# EAGLE design rapidshark_mark_6.11 (EAGLE 6.5.0)
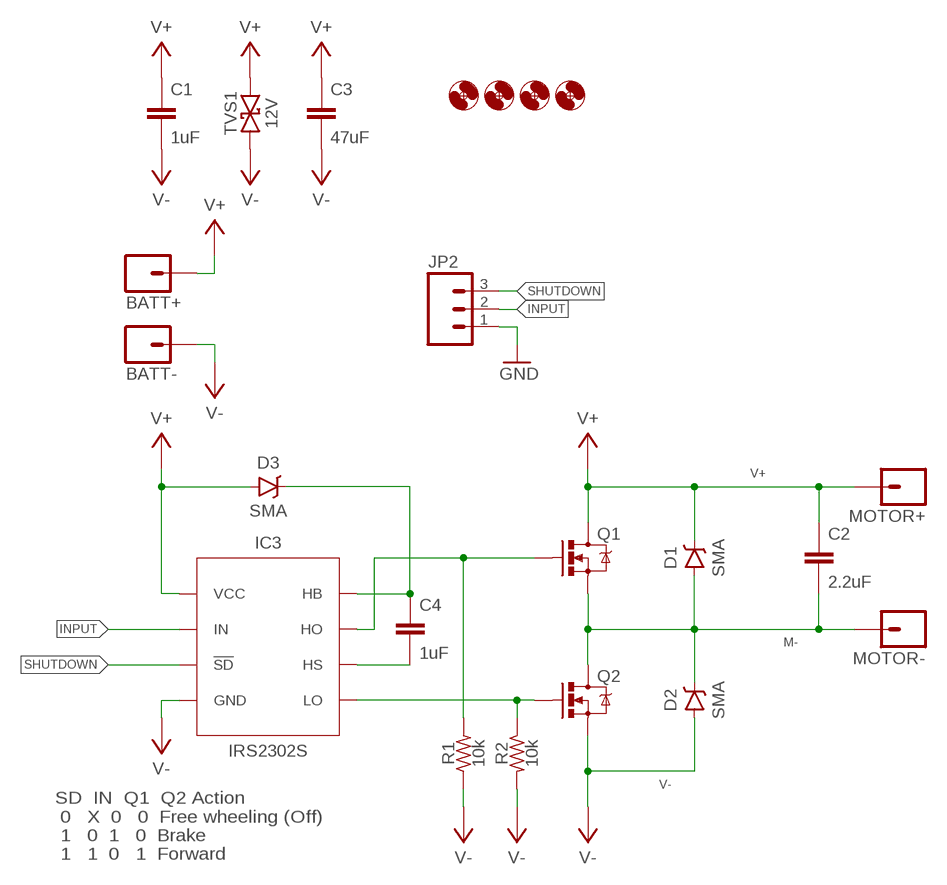
[diagram p0: schematic, sheet 1]

## Parts
BATT+  M01PTH_2MM  [1X01_2MM]
BATT-  M01PTH_2MM  [1X01_2MM]
C1  1uF  CAPACITOR-CERAMICC0805  [C0805]
C2  2.2uF  CAPACITOR-CERAMICC0805  [C0805]
C3  47uF  CAPACITOR-CERAMICC1206  [C1206]
C4  1uF  CAPACITOR-CERAMICC0805  [C0805]
D1  SMA  DIODE-SCHOTTKYSMA  [SMA-DIODE-SCHOTTKY]
D2  SMA  DIODE-SCHOTTKYSMA  [SMA-DIODE-SCHOTTKY]
D3  SMA  DIODE-SCHOTTKYSMA  [SMA-DIODE-SCHOTTKY]
H1  HOLE#2  [HOLE-#2]
H2  HOLE#2  [HOLE-#2]
H3  HOLE#2  [HOLE-#2]
H4  HOLE#2  [HOLE-#2]
IC3  IRS2302S  [SO08]
JP2  M03JST-PTH  [JST-3-PH-RA-PTH]
MOTOR+  M01PTH_2MM  [1X01_2MM]
MOTOR-  M01PTH_2MM  [1X01_2MM]
Q1  MOSFET-NCHANNELPSMN4R0-30YLD  [LFPAK56]
Q2  MOSFET-NCHANNELPSMN4R0-30YLD  [LFPAK56]
R1  10k  RESISTORR0805  [R0805]
R2  10k  RESISTORR0805  [R0805]
TVS1  12V  TVSDO-41-10.16MM  [DO-41-TVS-BI-10.16MM]

## Nets
GND: JP2.1
INPUT: IC3.2(IN) JP2.2
M-: C2.2 D1.A D2.C MOTOR-.1 Q1.1(S) Q1.2(S) Q1.3(S) Q2.MB@1(D) Q2.MB@2(D)
N$2: IC3.7(HO) Q1.4(G) R1.2
N$3: IC3.5(LO) Q2.4(G) R2.1
N$6: C4.1 D3.C IC3.8(HB)
N$7: C4.2 IC3.6(HS)
SHUTDOWN: IC3.3(!SD) JP2.3
V+: BATT+.1 C1.1 C2.1 C3.1 D1.C D3.A IC3.1(VCC) MOTOR+.1 Q1.MB@1(D) Q1.MB@2(D) TVS1.P$1
V-: BATT-.1 C1.2 C3.2 D2.A IC3.4(GND) Q2.1(S) Q2.2(S) Q2.3(S) R1.1 R2.2 TVS1.P$2

## Notes on the sheet
- SD  IN  Q1  Q2 Action
   0   X  0   0  Free wheeling (Off)
   1   0  1   0  Brake
   1   1  0   1  Forward

## Library data of the parts
BATT+ BATT- MOTOR+ MOTOR- = A_butts:M01: Header 1 Standard 1-pin 0.1" header. Use with straight break away headers (SKU : PRT-00116), right angle break away headers (PRT-00553), swiss pins (PRT-00743), machine pins (PRT-00117), and female headers (PRT-00115).
C1-C4 = A_butts:CAPACITOR-CERAMIC: CAPACITOR, European symbol
D1-D3 = A_butts:DIODE-SCHOTTKY: Schottky diodes in SFE's production catalog BAT20J 1A 23V 0.62Vf RB751 120mA 40V 0.37Vf PMEG4005EJ 0.5A 40V 0.42Vf MBRA140 1A 40V 0.5Vf B340A 3A 40V SMA
H1-H4 = A_butts:HOLE: MOUNTING HOLE with drill center marker
IC3 = A_butts:IRS2302S
JP2 = A_butts:M03: Header 3 Standard 3-pin 0.1" header. Use with straight break away headers (SKU : PRT-00116), right angle break away headers (PRT-00553), swiss pins (PRT-00743), machine pins (PRT-00117), and female headers (PRT-00115). Molex polarized connector foot print use with SKU : PRT-08232 with associated crimp pins and housings.; SKU: PRT-09915
Q1 Q2 = A_butts:MOSFET-NCHANNEL: Common NMOSFET Parts MFG P/N Store ID Prod ID FDD8780 TRANS-09984 SI7820DN TRANS-11055 FDS6630A IC-08089 2N7002PW TRANS-11151 FQP30N06L COM-10213 TRANS-10060 BSS123LT1G TRANS-08345 BSS138 TRANS-00830 BS170 2N7000
R1 R2 = A_butts:RESISTOR: RESISTOR, American symbol
TVS1 = A_butts:TVS: Transient voltage suppressor- prevents ESD on inputs. Ignore package description- MBRA140 is NOT this type of part!!!

## Board
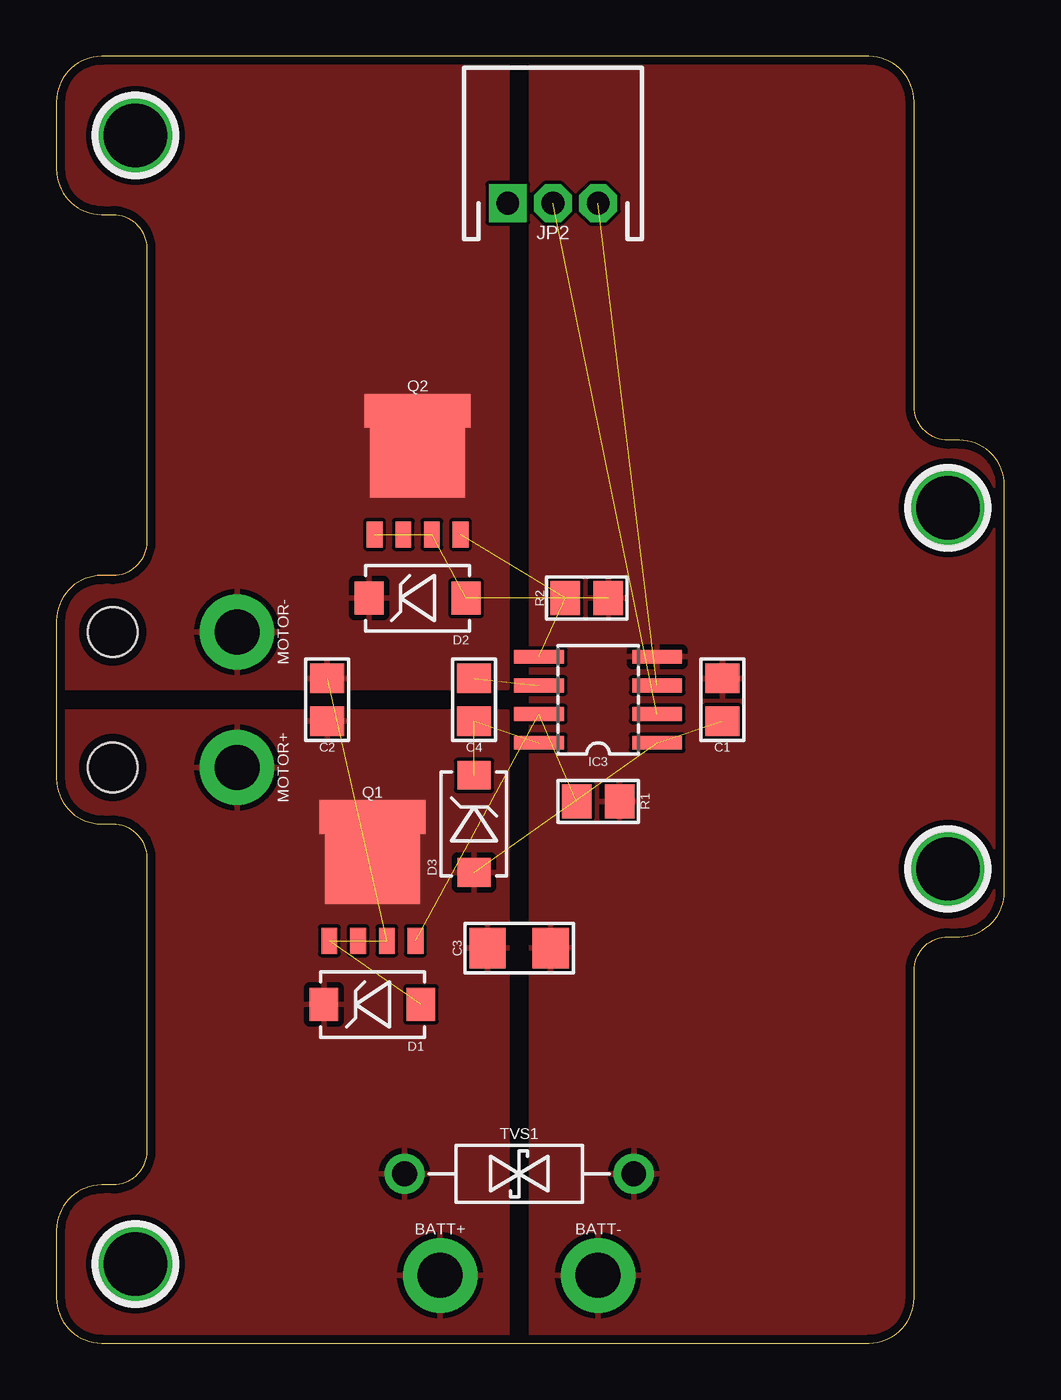
[diagram p1: board, top side]
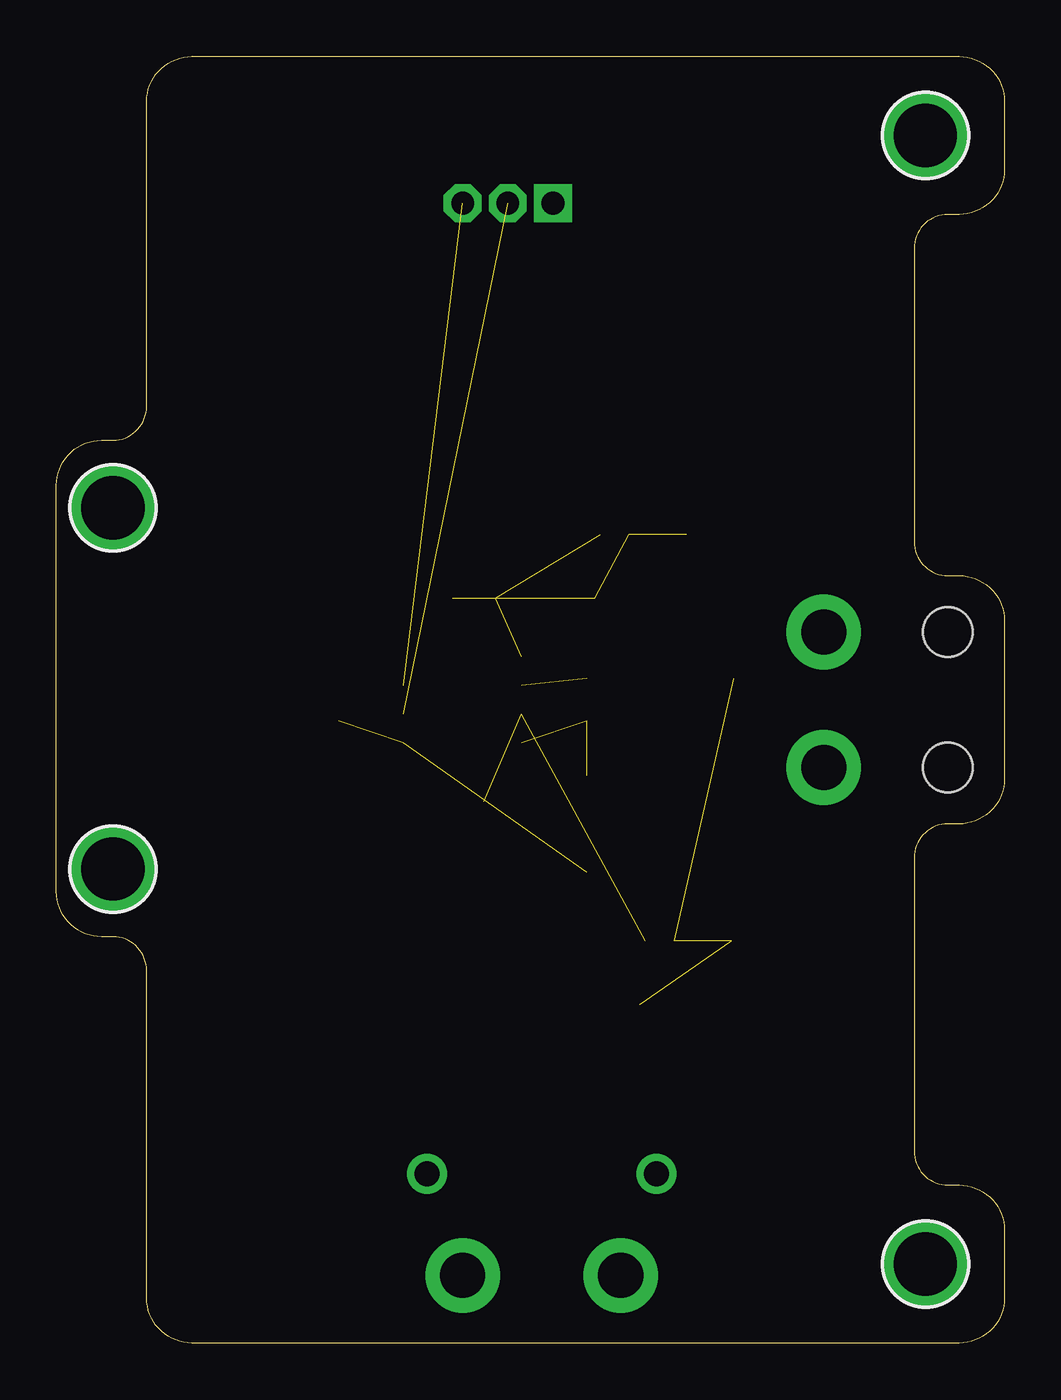
[diagram p2: board, bottom side, seen from below]

Size 42 x 57 mm. Coordinates in mm from the lower left corner, seen from the top.
Outline: 0,5 0,2 arc90 2,0 36,0 arc90 38,2 38,16.5 arc-90 39.5,18 40,18 arc90 42,20 42,38 arc90 40,40 39.5,40 arc-90 38,41.5 38,55 arc90 36,57 2,57 arc90 0,55 0,52 arc90 2,50 2.5,50 arc-90 4,48.5 4,35.5 arc-90 2.5,34 2,34 arc90 0,32 0,25 arc90 2,23 2.5,23 arc-90 4,21.5 4,8.5 arc-90 2.5,7 2,7 arc90 0,5
Copper layers (1*16): Top 0.0356mm / dielectric 1.5011mm / Bottom 0.0356mm
Design rules "LaenPCBOrder_2": minimum track width 6mil, minimum drill 13mil, track to track 6mil, track to pad 6mil, pad to pad 6mil, via to via 6mil, smd to smd 6mil, copper to edge 15mil, drill to drill 6mil, minimum pad ring 7mil, minimum via ring 7mil, stop-mask expansion 3mil, vias tented up to drill 20mil, thermal gap 10mil
Holes 2.2 mm at 2.5,31.5 2.5,25.5

### Footprints (pad centres in the part's own frame; a part is rotated, then mirrored left to right if it is on the bottom)
1X01_2MM = drill 2 pad 3.302: 1 0,0
C0805 = smd 1.3 x 1.5: 1 -0.95,0; 2 0.95,0
C1206 = smd 1.6 x 1.8: 1 -1.4,0; 2 1.4,0
SMA-DIODE-SCHOTTKY = smd 1.27 x 1.47: A -2.15,0; C 2.15,0
HOLE-#2 = drill 2.8 pad 3.81: P$1 0,0
SO08 = smd 0.61 x 2.21: 1 -1.905,-2.616; 2 -0.635,-2.616; 3 0.635,-2.616; 4 1.905,-2.616; 5 1.905,2.616; 6 0.635,2.616; 7 -0.635,2.616; 8 -1.905,2.616
JST-3-PH-RA-PTH = drill 1 pad 1.676 square: 1 -2,0 | drill 1 pad 1.676 octagon: 2 0,0; 3 2,0
LFPAK56 = smd 0.7 x 1.15: 1 -1.905,-3.175; 2 -0.635,-3.175; 3 0.635,-3.175; 4 1.905,-3.175 | smd 4.2 x 3.1: MB@1 0,0 | smd 4.7 x 1.5: MB@2 0,2.3
R0805 = smd 1.3 x 1.5: 1 -0.95,0; 2 0.95,0
DO-41-TVS-BI-10.16MM = drill 1.1 pad 1.778: P$1 -5.08,0; P$2 5.08,0

### Placement (x,y rotation side)
BATT+  17,3 0 top
BATT-  24,3 0 top
C1  29.5,28.5 90 top
C2  12,28.5 90 top
C3  20.5,17.5 0 top
C4  18.5,28.5 90 top
D1  14,15 180 top
D2  16,33 180 top
D3  18.5,23 90 top
H1  3.5,3.5 0 top
H2  3.5,53.5 0 top
H3  39.5,21 0 top
H4  39.5,37 0 top
IC3  24,28.5 90 top
JP2  22,50.5 0 top
MOTOR+  8,25.5 270 top
MOTOR-  8,31.5 270 top
Q1  14,21 0 top
Q2  16,39 0 top
R1  24,24 180 top
R2  23.5,33 0 top
TVS1  20.5,7.5 0 top

### Tracks (layer width: path | path; a pad name or v marks a point on that pad's centre or on a via)
INPUT  (1 unrouted)
M-  (4 unrouted)
  pour Top (isolate 0.152, rank 6): 0,29 0,57 20,57 20,29
N$2  (2 unrouted)
N$3  (2 unrouted)
N$6  (2 unrouted)
N$7  (1 unrouted)
SHUTDOWN  (1 unrouted)
V+  (2 unrouted)
  pour Top (isolate 0.152, rank 6): 0,28 20,28 20,0 0,0
V-  (4 unrouted)
  pour Top (isolate 0.152, rank 6): 21,0 21,57 42,57 42,0